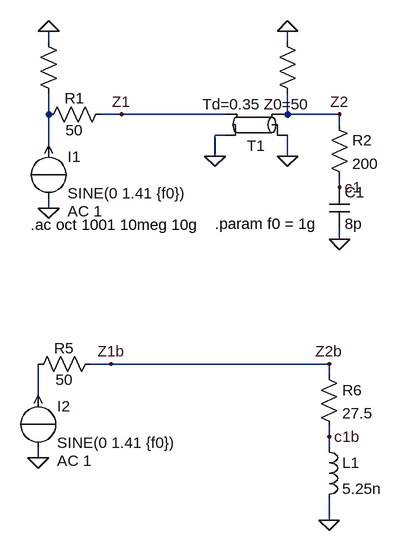
[diagram p0: schematic Draft3.asc]
Draft3.asc, the LTspice schematic file:
Version 4
SHEET 1 880 680
WIRE -320 -192 -320 -208
WIRE 48 -192 48 -208
WIRE -320 -80 -320 -112
WIRE -208 -80 -240 -80
WIRE -48 -80 -208 -80
WIRE 48 -80 48 -112
WIRE 128 -80 48 -80
WIRE 128 -64 128 -80
WIRE -48 -48 -64 -48
WIRE -320 -32 -320 -80
WIRE -64 -16 -64 -48
WIRE 48 -16 48 -48
WIRE 128 32 128 16
WIRE -320 64 -320 48
WIRE 128 112 128 96
WIRE -224 304 -256 304
WIRE 112 304 -224 304
WIRE 112 320 112 304
WIRE -336 352 -336 304
WIRE 112 416 112 400
WIRE 112 432 112 416
WIRE -336 448 -336 432
WIRE 112 544 112 512
FLAG -320 64 0
FLAG 48 -208 0
FLAG -320 -208 0
FLAG 128 -80 Z2
FLAG -208 -80 Z1
FLAG -64 -16 0
FLAG 48 -16 0
FLAG 128 112 0
FLAG 128 32 c1
FLAG -336 448 0
FLAG 112 304 Z2b
FLAG -224 304 Z1b
FLAG 112 544 0
FLAG 112 416 c1b
SYMBOL source-I -320 -32 R0
WINDOW 123 29 101 Left 2
WINDOW 39 0 0 Left 2
SYMATTR Value2 AC 1
SYMATTR InstName I1
SYMATTR Value SINE(0 1.41 {f0})
SYMBOL res -336 -64 R270
WINDOW 0 25 56 VTop 2
WINDOW 3 7 56 VBottom 2
SYMATTR InstName R1
SYMATTR Value 50
SYMBOL res 112 -80 R0
SYMATTR InstName R2
SYMATTR Value 200
SYMBOL res -336 -208 R0
WINDOW 0 36 40 Invisible 2
WINDOW 3 36 76 Invisible 2
SYMATTR InstName R3
SYMATTR Value 100meg
SYMBOL res 32 -208 R0
WINDOW 0 36 40 Invisible 2
WINDOW 3 36 76 Invisible 2
SYMATTR InstName R4
SYMATTR Value 100meg
SYMBOL tline 0 -64 R180
SYMATTR InstName T1
SYMATTR Value Td=0.35 Z0=50
SYMBOL cap 112 32 R0
SYMATTR InstName C1
SYMATTR Value 8p
SYMBOL source-I -336 352 R0
WINDOW 123 29 101 Left 2
WINDOW 39 0 0 Left 2
SYMATTR Value2 AC 1
SYMATTR InstName I2
SYMATTR Value SINE(0 1.41 {f0})
SYMBOL res -352 320 R270
WINDOW 0 25 56 VTop 2
WINDOW 3 7 56 VBottom 2
SYMATTR InstName R5
SYMATTR Value 50
SYMBOL res 96 304 R0
SYMATTR InstName R6
SYMATTR Value 27.5
SYMBOL ind 96 416 R0
SYMATTR InstName L1
SYMATTR Value 5.25n
TEXT -348 90 Left 2 !.ac oct 1001 10meg 10g
TEXT -64 88 Left 2 !.param f0 = 1g

The netlist it stands for:
* Draft3.asc
I1 0 N001 SINE(0 1.41 {f0}) AC 1
R1 N001 Z1 50
R2 Z2 c1 200
R3 0 N001 100meg
R4 0 Z2 100meg
T1 0 Z2 0 Z1 Td=0.35 Z0=50
C1 c1 0 8p
I2 0 N002 SINE(0 1.41 {f0}) AC 1
R5 N002 Z1b 50
R6 Z1b c1b 27.5
L1 c1b 0 5.25n
.ac oct 1001 10meg 10g
.param f0 = 1g
.backanno
.end